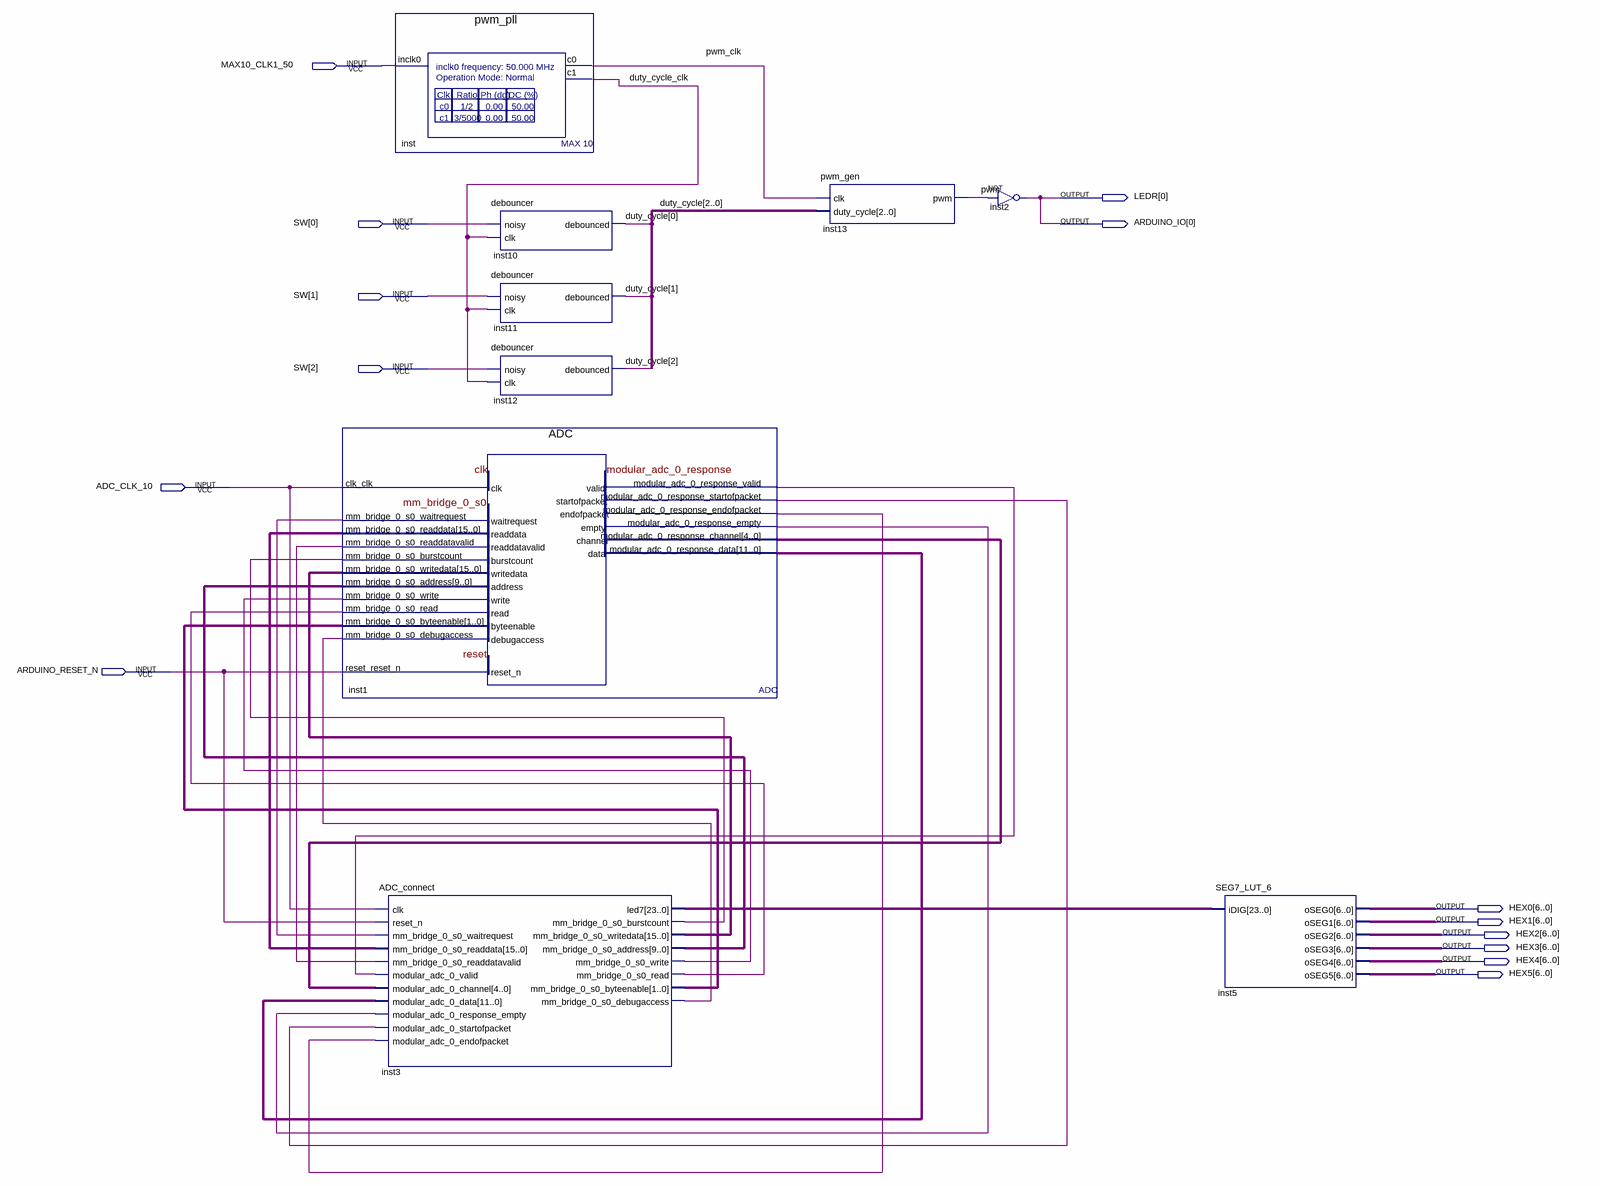
[diagram p0: schematic sheet]
// Quartus schematic pwm_led_top.bdf as structural Verilog: 9 symbols, 14 pins
module pwm_led_top (
  input  MAX10_CLK1_50,
  input  [2:0] SW,
  input  ADC_CLK_10,
  input  ARDUINO_RESET_N,
  output [0:0] LEDR,
  output [0:0] ARDUINO_IO,
  output [6:0] HEX0,
  output [6:0] HEX1,
  output [6:0] HEX2,
  output [6:0] HEX3,
  output [6:0] HEX4,
  output [6:0] HEX5
);

  wire duty_cycle_clk, inst1_mm_bridge_0_s0_readdatavalid, inst1_mm_bridge_0_s0_waitrequest,
       inst1_modular_adc_0_response_empty, inst1_modular_adc_0_response_endofpacket,
       inst1_modular_adc_0_response_startofpacket, inst1_modular_adc_0_response_valid,
       inst3_mm_bridge_0_s0_burstcount, inst3_mm_bridge_0_s0_debugaccess, inst3_mm_bridge_0_s0_read,
       inst3_mm_bridge_0_s0_write, pwm, pwm_clk;
  wire [1:0] inst3_mm_bridge_0_s0_byteenable;
  wire [2:0] duty_cycle;
  wire [4:0] inst1_modular_adc_0_response_channel;
  wire [9:0] inst3_mm_bridge_0_s0_address;
  wire [11:0] inst1_modular_adc_0_response_data;
  wire [15:0] inst1_mm_bridge_0_s0_readdata, inst3_mm_bridge_0_s0_writedata;
  wire [23:0] inst3_led7;

  ADC inst1 (
    .clk_clk(ADC_CLK_10), .mm_bridge_0_s0_burstcount(inst3_mm_bridge_0_s0_burstcount),
    .mm_bridge_0_s0_writedata(inst3_mm_bridge_0_s0_writedata),
    .mm_bridge_0_s0_address(inst3_mm_bridge_0_s0_address), .mm_bridge_0_s0_write(inst3_mm_bridge_0_s0_write),
    .mm_bridge_0_s0_read(inst3_mm_bridge_0_s0_read),
    .mm_bridge_0_s0_byteenable(inst3_mm_bridge_0_s0_byteenable),
    .mm_bridge_0_s0_debugaccess(inst3_mm_bridge_0_s0_debugaccess), .reset_reset_n(ARDUINO_RESET_N),
    .mm_bridge_0_s0_waitrequest(inst1_mm_bridge_0_s0_waitrequest),
    .mm_bridge_0_s0_readdata(inst1_mm_bridge_0_s0_readdata),
    .mm_bridge_0_s0_readdatavalid(inst1_mm_bridge_0_s0_readdatavalid),
    .modular_adc_0_response_valid(inst1_modular_adc_0_response_valid),
    .modular_adc_0_response_startofpacket(inst1_modular_adc_0_response_startofpacket),
    .modular_adc_0_response_endofpacket(inst1_modular_adc_0_response_endofpacket),
    .modular_adc_0_response_empty(inst1_modular_adc_0_response_empty),
    .modular_adc_0_response_channel(inst1_modular_adc_0_response_channel),
    .modular_adc_0_response_data(inst1_modular_adc_0_response_data));
  ADC_connect inst3 (
    .clk(ADC_CLK_10), .reset_n(ARDUINO_RESET_N),
    .mm_bridge_0_s0_waitrequest(inst1_mm_bridge_0_s0_waitrequest),
    .mm_bridge_0_s0_readdata(inst1_mm_bridge_0_s0_readdata),
    .mm_bridge_0_s0_readdatavalid(inst1_mm_bridge_0_s0_readdatavalid),
    .modular_adc_0_valid(inst1_modular_adc_0_response_valid),
    .modular_adc_0_channel(inst1_modular_adc_0_response_channel),
    .modular_adc_0_data(inst1_modular_adc_0_response_data),
    .modular_adc_0_response_empty(inst1_modular_adc_0_response_empty),
    .modular_adc_0_startofpacket(inst1_modular_adc_0_response_startofpacket),
    .modular_adc_0_endofpacket(inst1_modular_adc_0_response_endofpacket), .led7(inst3_led7),
    .mm_bridge_0_s0_burstcount(inst3_mm_bridge_0_s0_burstcount),
    .mm_bridge_0_s0_writedata(inst3_mm_bridge_0_s0_writedata),
    .mm_bridge_0_s0_address(inst3_mm_bridge_0_s0_address), .mm_bridge_0_s0_write(inst3_mm_bridge_0_s0_write),
    .mm_bridge_0_s0_read(inst3_mm_bridge_0_s0_read),
    .mm_bridge_0_s0_byteenable(inst3_mm_bridge_0_s0_byteenable),
    .mm_bridge_0_s0_debugaccess(inst3_mm_bridge_0_s0_debugaccess));
  pwm_pll inst (.inclk0(MAX10_CLK1_50), .c0(pwm_clk), .c1(duty_cycle_clk));
  debouncer inst10 (.noisy(SW[0]), .clk(duty_cycle_clk), .debounced(duty_cycle[0]));
  debouncer inst11 (.noisy(SW[1]), .clk(duty_cycle_clk), .debounced(duty_cycle[1]));
  debouncer inst12 (.noisy(SW[2]), .clk(duty_cycle_clk), .debounced(duty_cycle[2]));
  pwm_gen inst13 (.clk(pwm_clk), .duty_cycle(duty_cycle), .pwm(pwm));
  not inst2 (ARDUINO_IO[0], pwm);
  SEG7_LUT_6 inst5 (
    .iDIG(inst3_led7), .oSEG0(HEX0), .oSEG1(HEX1), .oSEG2(HEX2), .oSEG3(HEX3), .oSEG4(HEX4), .oSEG5(HEX5));

  assign LEDR[0] = ARDUINO_IO[0];
endmodule
